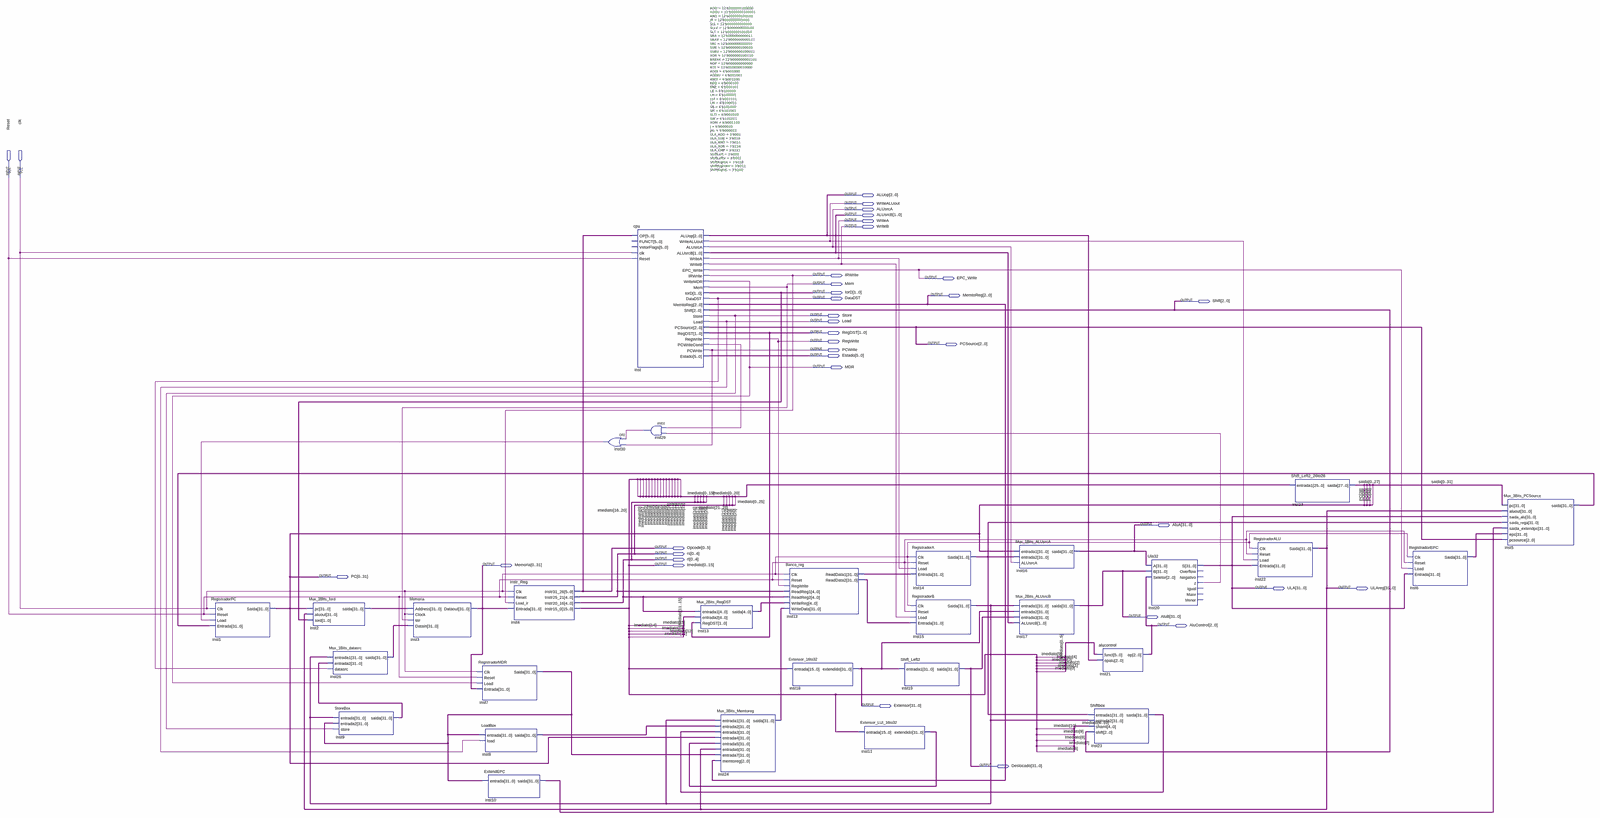
[diagram p0: schematic sheet, whole]
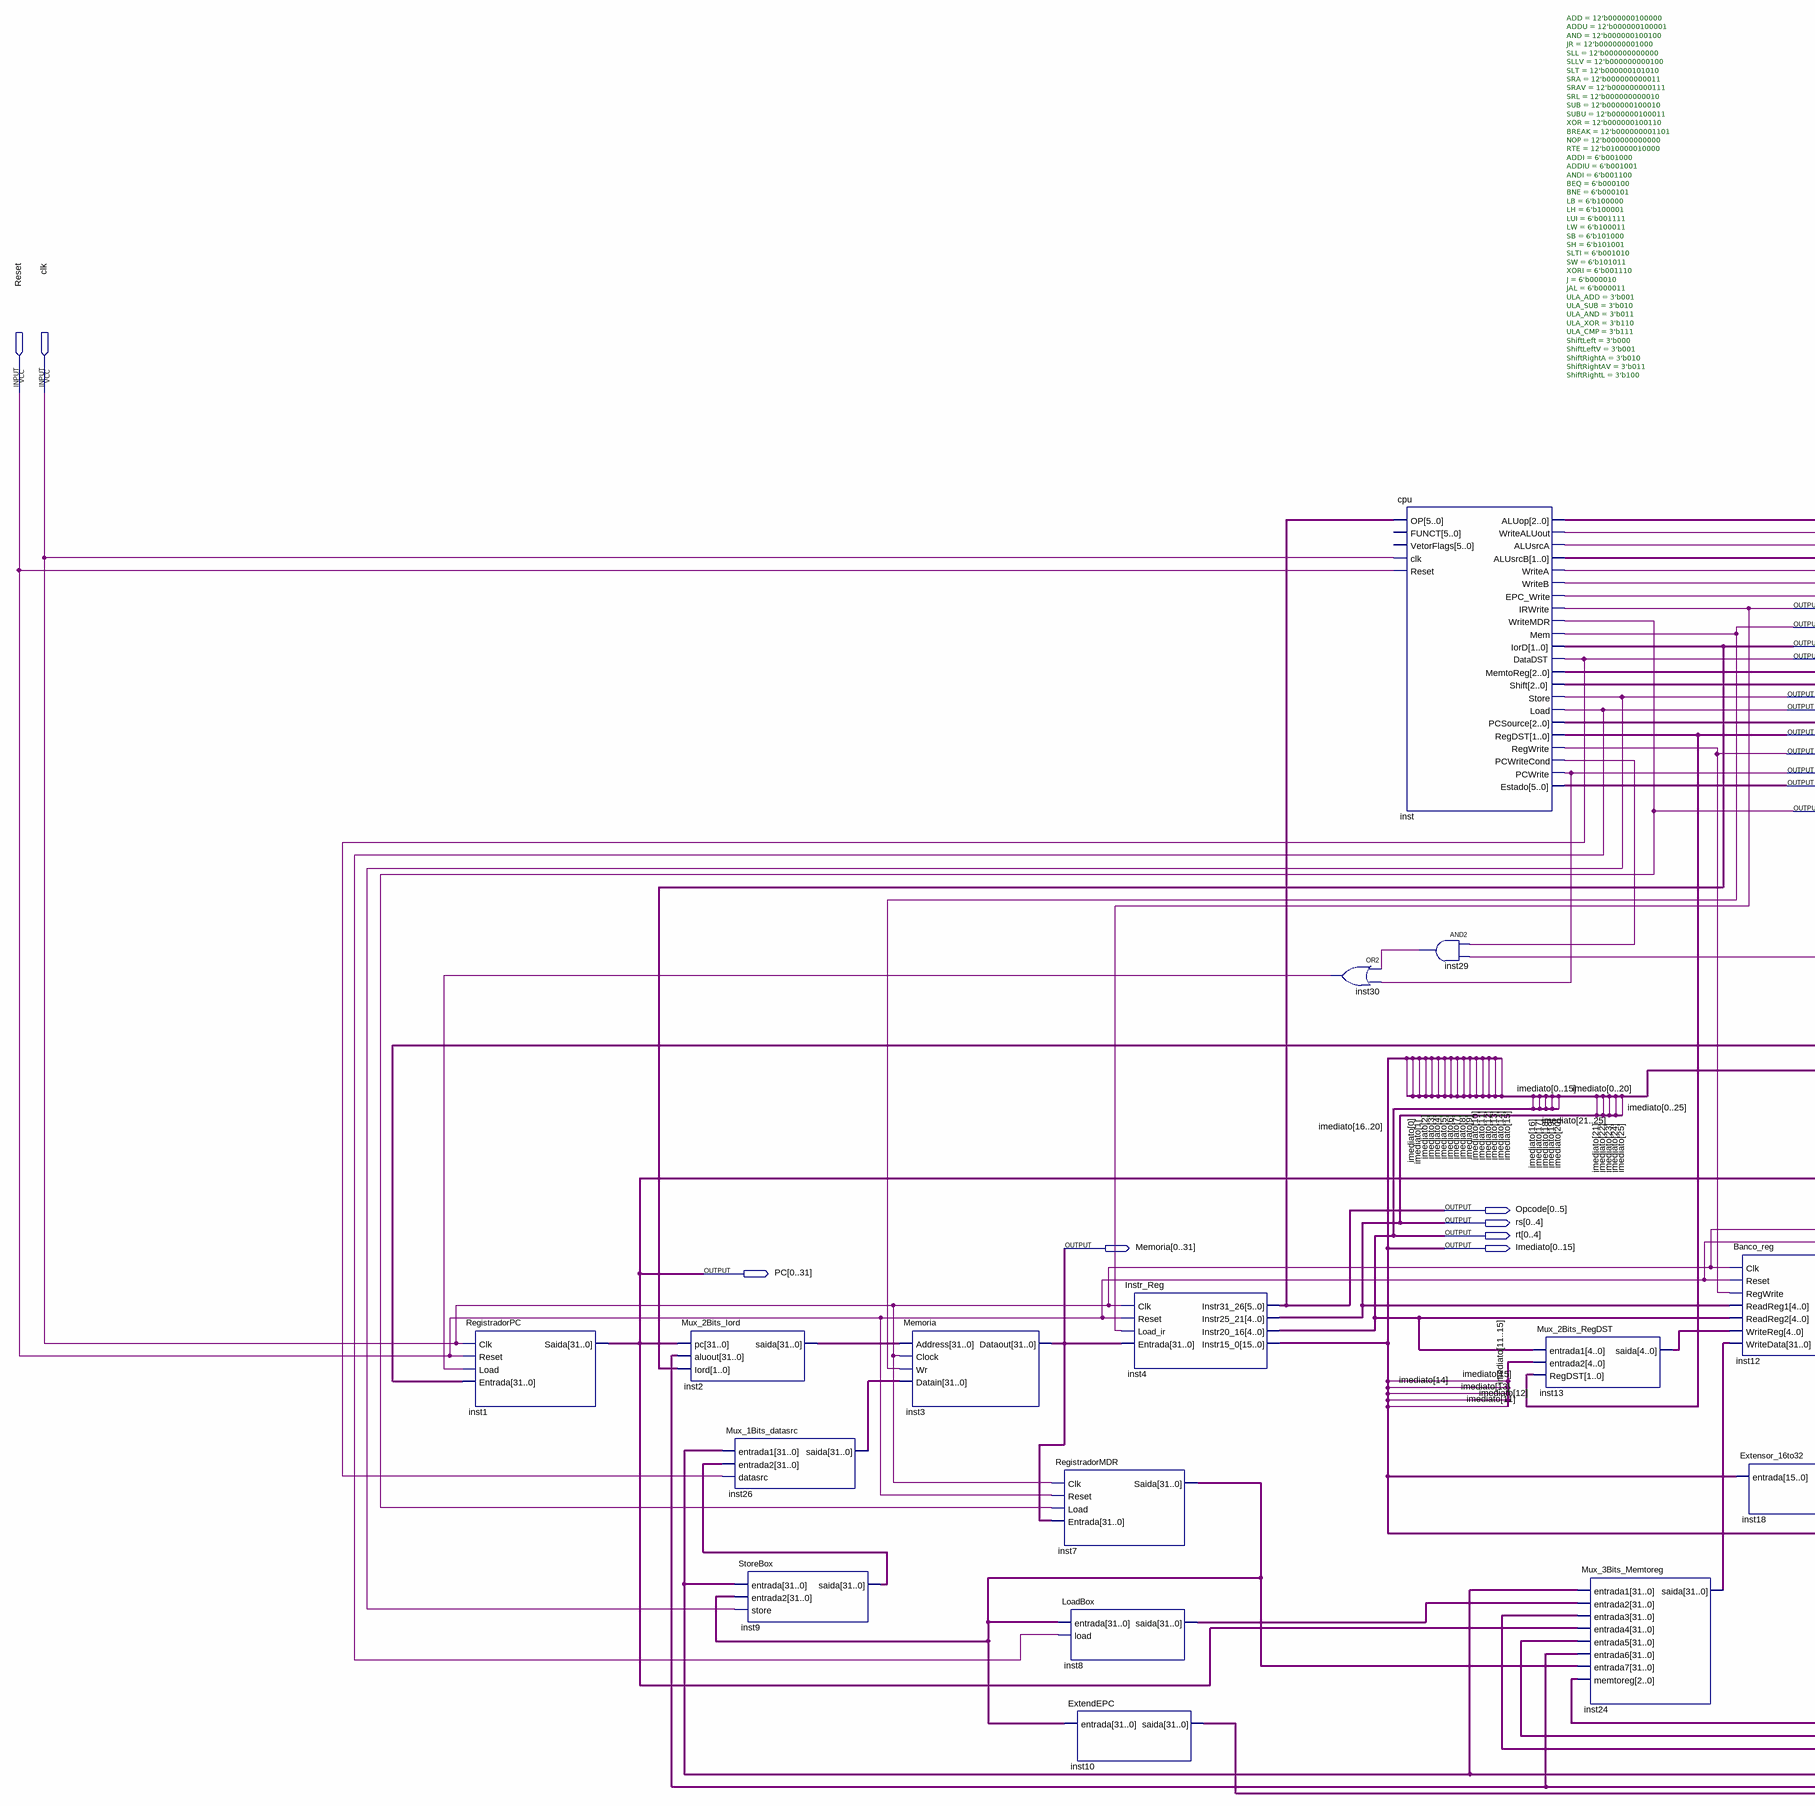
[diagram p1: schematic sheet, left part]
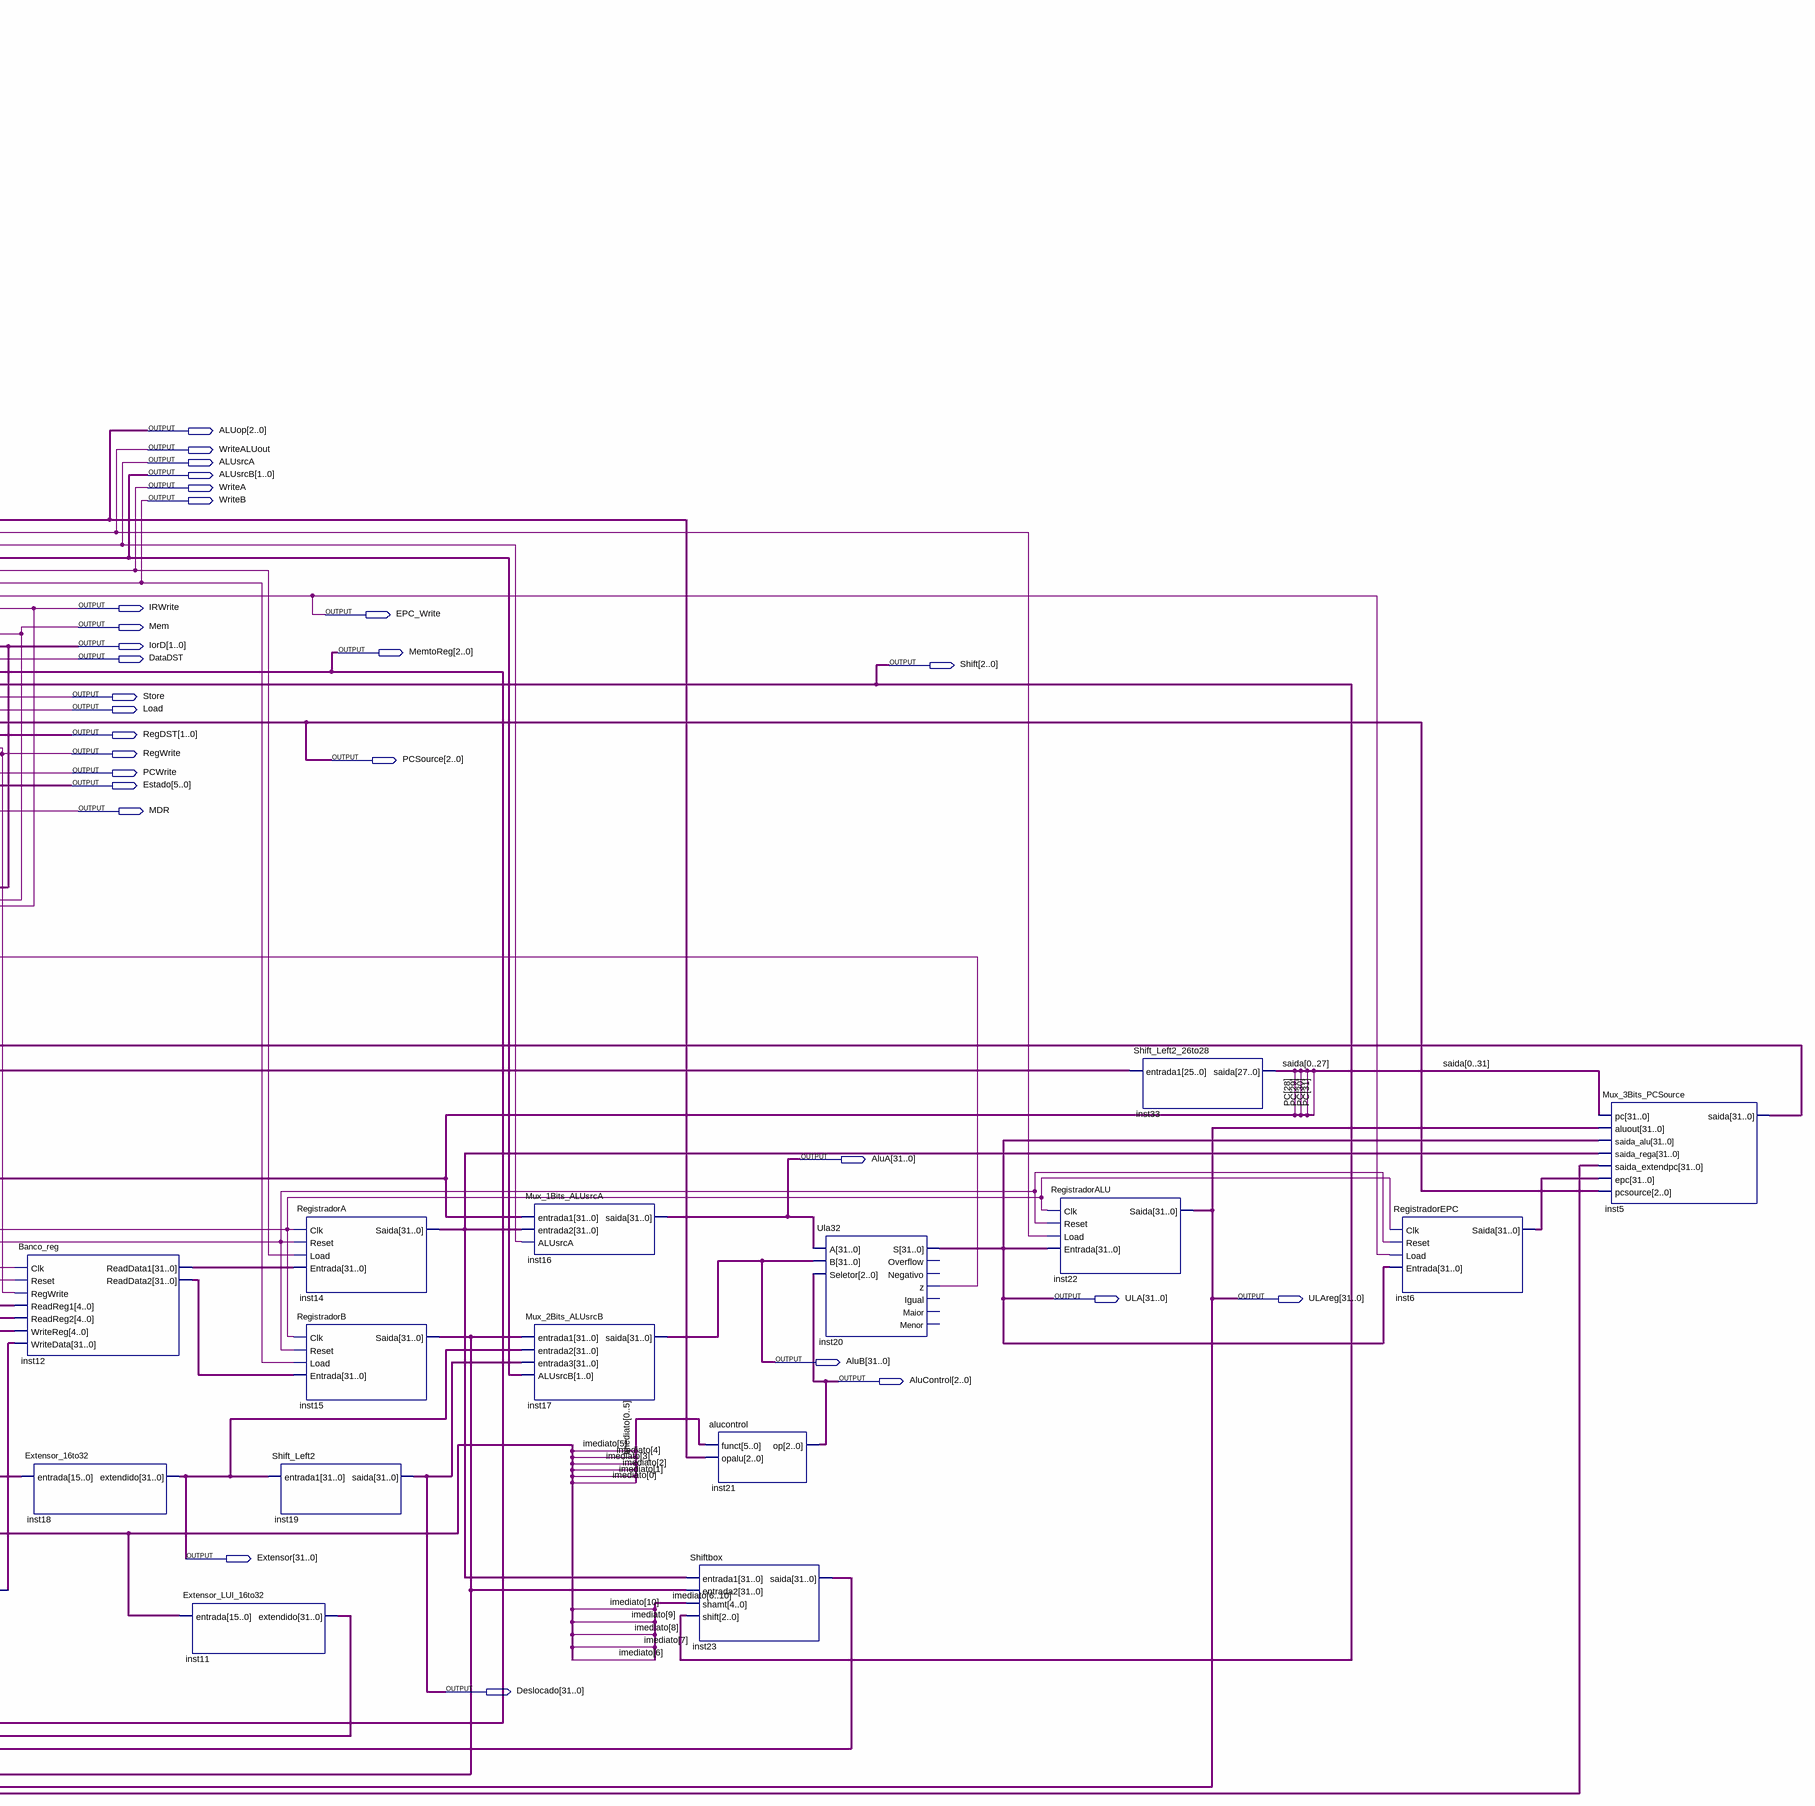
[diagram p2: schematic sheet, right part]
// Quartus schematic ProjetoHW.bdf as structural Verilog: 29 symbols, 36 pins
module ProjetoHW (
  input  Reset,
  input  clk,
  output [2:0] ALUop,
  output WriteALUout,
  output ALUsrcA,
  output [1:0] ALUsrcB,
  output WriteA,
  output WriteB,
  output IRWrite,
  output EPC_Write,
  output Mem,
  output [1:0] IorD,
  output [2:0] MemtoReg,
  output DataDST,
  output [2:0] Shift,
  output Store,
  output Load,
  output [1:0] RegDST,
  output RegWrite,
  output [2:0] PCSource,
  output PCWrite,
  output [5:0] Estado,
  output MDR,
  output [31:0] AluA,
  output [0:5] Opcode,
  output [0:4] rs,
  output [0:4] rt,
  output [0:31] Memoria,
  output [0:15] Imediato,
  output [0:31] PC,
  output [31:0] ULA,
  output [31:0] ULAreg,
  output [31:0] AluB,
  output [2:0] AluControl,
  output [31:0] Extensor,
  output [31:0] Deslocado
);

  wire inst20_z, inst29_out, inst30_out, inst_pcwritecond;
  wire [4:0] inst13_saida;
  wire [31:0] inst2_saida, inst5_saida, inst6_saida, inst7_saida, inst8_saida, inst9_saida, inst10_saida,
       inst11_extendido, inst12_readdata1, inst12_readdata2, inst14_saida, inst15_saida, inst23_saida,
       inst24_saida, inst26_saida, saida;

  RegistradorPC inst1 (.Clk(clk), .Reset(Reset), .Load(inst30_out), .Entrada(inst5_saida), .Saida(PC));
  Mux_2Bits_Iord inst2 (.pc(PC), .aluout(ULAreg), .Iord(IorD), .saida(inst2_saida));
  Mux_1Bits_datasrc inst26 (.entrada1(inst15_saida), .entrada2(inst9_saida), .datasrc(DataDST), .saida(inst26_saida));
  StoreBox inst9 (.entrada(inst15_saida), .entrada2(inst7_saida), .store(Store), .saida(inst9_saida));
  Memoria inst3 (.Address(inst2_saida), .Clock(clk), .Wr(Mem), .Datain(inst26_saida), .Dataout(Memoria));
  RegistradorMDR inst7 (.Clk(clk), .Reset(Reset), .Load(MDR), .Entrada(Memoria), .Saida(inst7_saida));
  LoadBox inst8 (.entrada(inst7_saida), .load(Load), .saida(inst8_saida));
  ExtendEPC inst10 (.entrada(inst7_saida), .saida(inst10_saida));
  Instr_Reg inst4 (
    .Clk(clk), .Reset(Reset), .Load_ir(IRWrite), .Entrada(Memoria), .Instr31_26(Opcode), .Instr25_21(rs),
    .Instr20_16(rt), .Instr15_0(Imediato));
  or inst30 (inst30_out, inst29_out, PCWrite);
  cpu #(.ADD(12'b000000100000), .ADDU(12'b000000100001), .AND(12'b000000100100), .JR(12'b000000001000), .SLL(12'b000000000000), .SLLV(12'b000000000100), .SLT(12'b000000101010), .SRA(12'b000000000011), .SRAV(12'b000000000111), .SRL(12'b000000000010), .SUB(12'b000000100010), .SUBU(12'b000000100011), .XOR(12'b000000100110), .BREAK(12'b000000001101), .NOP(12'b000000000000), .RTE(12'b010000010000), .ADDI(6'b001000), .ADDIU(6'b001001), .ANDI(6'b001100), .BEQ(6'b000100), .BNE(6'b000101), .LB(6'b100000), .LH(6'b100001), .LUI(6'b001111), .LW(6'b100011), .SB(6'b101000), .SH(6'b101001), .SLTI(6'b001010), .SW(6'b101011), .XORI(6'b001110), .J(6'b000010), .JAL(6'b000011), .ULA_ADD(3'b001), .ULA_SUB(3'b010), .ULA_AND(3'b011), .ULA_XOR(3'b110), .ULA_CMP(3'b111), .ShiftLeft(3'b000), .ShiftLeftV(3'b001), .ShiftRightA(3'b010), .ShiftRightAV(3'b011), .ShiftRightL(3'b100)) inst (
    .OP(Opcode), .clk(clk), .Reset(Reset), .ALUop(ALUop), .WriteALUout(WriteALUout), .ALUsrcA(ALUsrcA),
    .ALUsrcB(ALUsrcB), .WriteA(WriteA), .WriteB(WriteB), .EPC_Write(EPC_Write), .IRWrite(IRWrite),
    .WriteMDR(MDR), .Mem(Mem), .IorD(IorD), .DataDST(DataDST), .MemtoReg(MemtoReg), .Shift(Shift),
    .Store(Store), .Load(Load), .PCSource(PCSource), .RegDST(RegDST), .RegWrite(RegWrite),
    .PCWriteCond(inst_pcwritecond), .PCWrite(PCWrite), .Estado(Estado));  // open: FUNCT, VetorFlags
  and inst29 (inst29_out, inst_pcwritecond, inst20_z);
  Mux_2Bits_RegDST inst13 (.entrada1(rt), .entrada2(Imediato[11:15]), .RegDST(RegDST), .saida(inst13_saida));
  Mux_3Bits_Memtoreg inst24 (
    .entrada1(inst15_saida), .entrada2(inst8_saida), .entrada3(inst23_saida), .entrada4(PC),
    .entrada5(inst11_extendido), .entrada6(ULAreg), .entrada7(inst7_saida), .memtoreg(MemtoReg),
    .saida(inst24_saida));
  Banco_reg inst12 (
    .Clk(clk), .Reset(Reset), .RegWrite(RegWrite), .ReadReg1(rs), .ReadReg2(rt), .WriteReg(inst13_saida),
    .WriteData(inst24_saida), .ReadData1(inst12_readdata1), .ReadData2(inst12_readdata2));
  Extensor_16to32 inst18 (.entrada(Imediato), .extendido(Extensor));
  Extensor_LUI_16to32 inst11 (.entrada(Imediato), .extendido(inst11_extendido));
  Shift_Left2 inst19 (.entrada1(Extensor), .saida(Deslocado));
  RegistradorA inst14 (.Clk(clk), .Reset(Reset), .Load(WriteA), .Entrada(inst12_readdata1), .Saida(inst14_saida));
  RegistradorB inst15 (.Clk(clk), .Reset(Reset), .Load(WriteB), .Entrada(inst12_readdata2), .Saida(inst15_saida));
  Mux_1Bits_ALUsrcA inst16 (.entrada1(PC), .entrada2(inst14_saida), .ALUsrcA(ALUsrcA), .saida(AluA));
  Mux_2Bits_ALUsrcB inst17 (
    .entrada1(inst15_saida), .entrada2(Extensor), .entrada3(Deslocado), .ALUsrcB(ALUsrcB), .saida(AluB));
  alucontrol inst21 (.funct(Imediato[0:5]), .opalu(ALUop), .op(AluControl));
  Shiftbox inst23 (
    .entrada1(inst14_saida), .entrada2(inst15_saida), .shamt(Imediato[6:10]), .shift(Shift),
    .saida(inst23_saida));
  Ula32 inst20 (
    .A(AluA), .B(AluB), .Seletor(AluControl), .S(ULA), .z(inst20_z));  // open: Overflow, Negativo, Igual, Maior, Menor
  RegistradorALU inst22 (.Clk(clk), .Reset(Reset), .Load(WriteALUout), .Entrada(ULA), .Saida(ULAreg));
  Shift_Left2_26to28 inst33 (
    .entrada1({Imediato, rt, rs}),
    .saida({saida[0], saida[1], saida[2], saida[3], saida[4], saida[5], saida[6], saida[7], saida[8], saida[9], saida[10], saida[11], saida[12], saida[13], saida[14], saida[15], saida[16], saida[17], saida[18], saida[19], saida[20], saida[21], saida[22], saida[23], saida[24], saida[25], saida[26], saida[27]}));
  RegistradorEPC inst6 (.Clk(clk), .Reset(Reset), .Load(EPC_Write), .Entrada(ULA), .Saida(inst6_saida));
  Mux_3Bits_PCSource inst5 (
    .pc({saida[0], saida[1], saida[2], saida[3], saida[4], saida[5], saida[6], saida[7], saida[8], saida[9], saida[10], saida[11], saida[12], saida[13], saida[14], saida[15], saida[16], saida[17], saida[18], saida[19], saida[20], saida[21], saida[22], saida[23], saida[24], saida[25], saida[26], saida[27], saida[28], saida[29], saida[30], saida[31]}),
    .aluout(ULAreg), .saida_alu(ULA), .saida_rega(inst14_saida), .saida_extendpc(inst10_saida),
    .epc(inst6_saida), .pcsource(PCSource), .saida(inst5_saida));

  // Other names for the same wires on the sheet: Imediato[25:16] = {rs[4], rs[3], rs[2], rs[1], rs[0], rt[4], rt[3], rt[2], rt[1], rt[0]}
endmodule
